# EasyEDA schematic IR-Controle-PC_EasyEDA.json
TITLE: Sheet_1; REV: 1.0; Date: 2026-01-11; Sheet: 1/1; Drawn By: sidneyhimuro; Company: Your Company
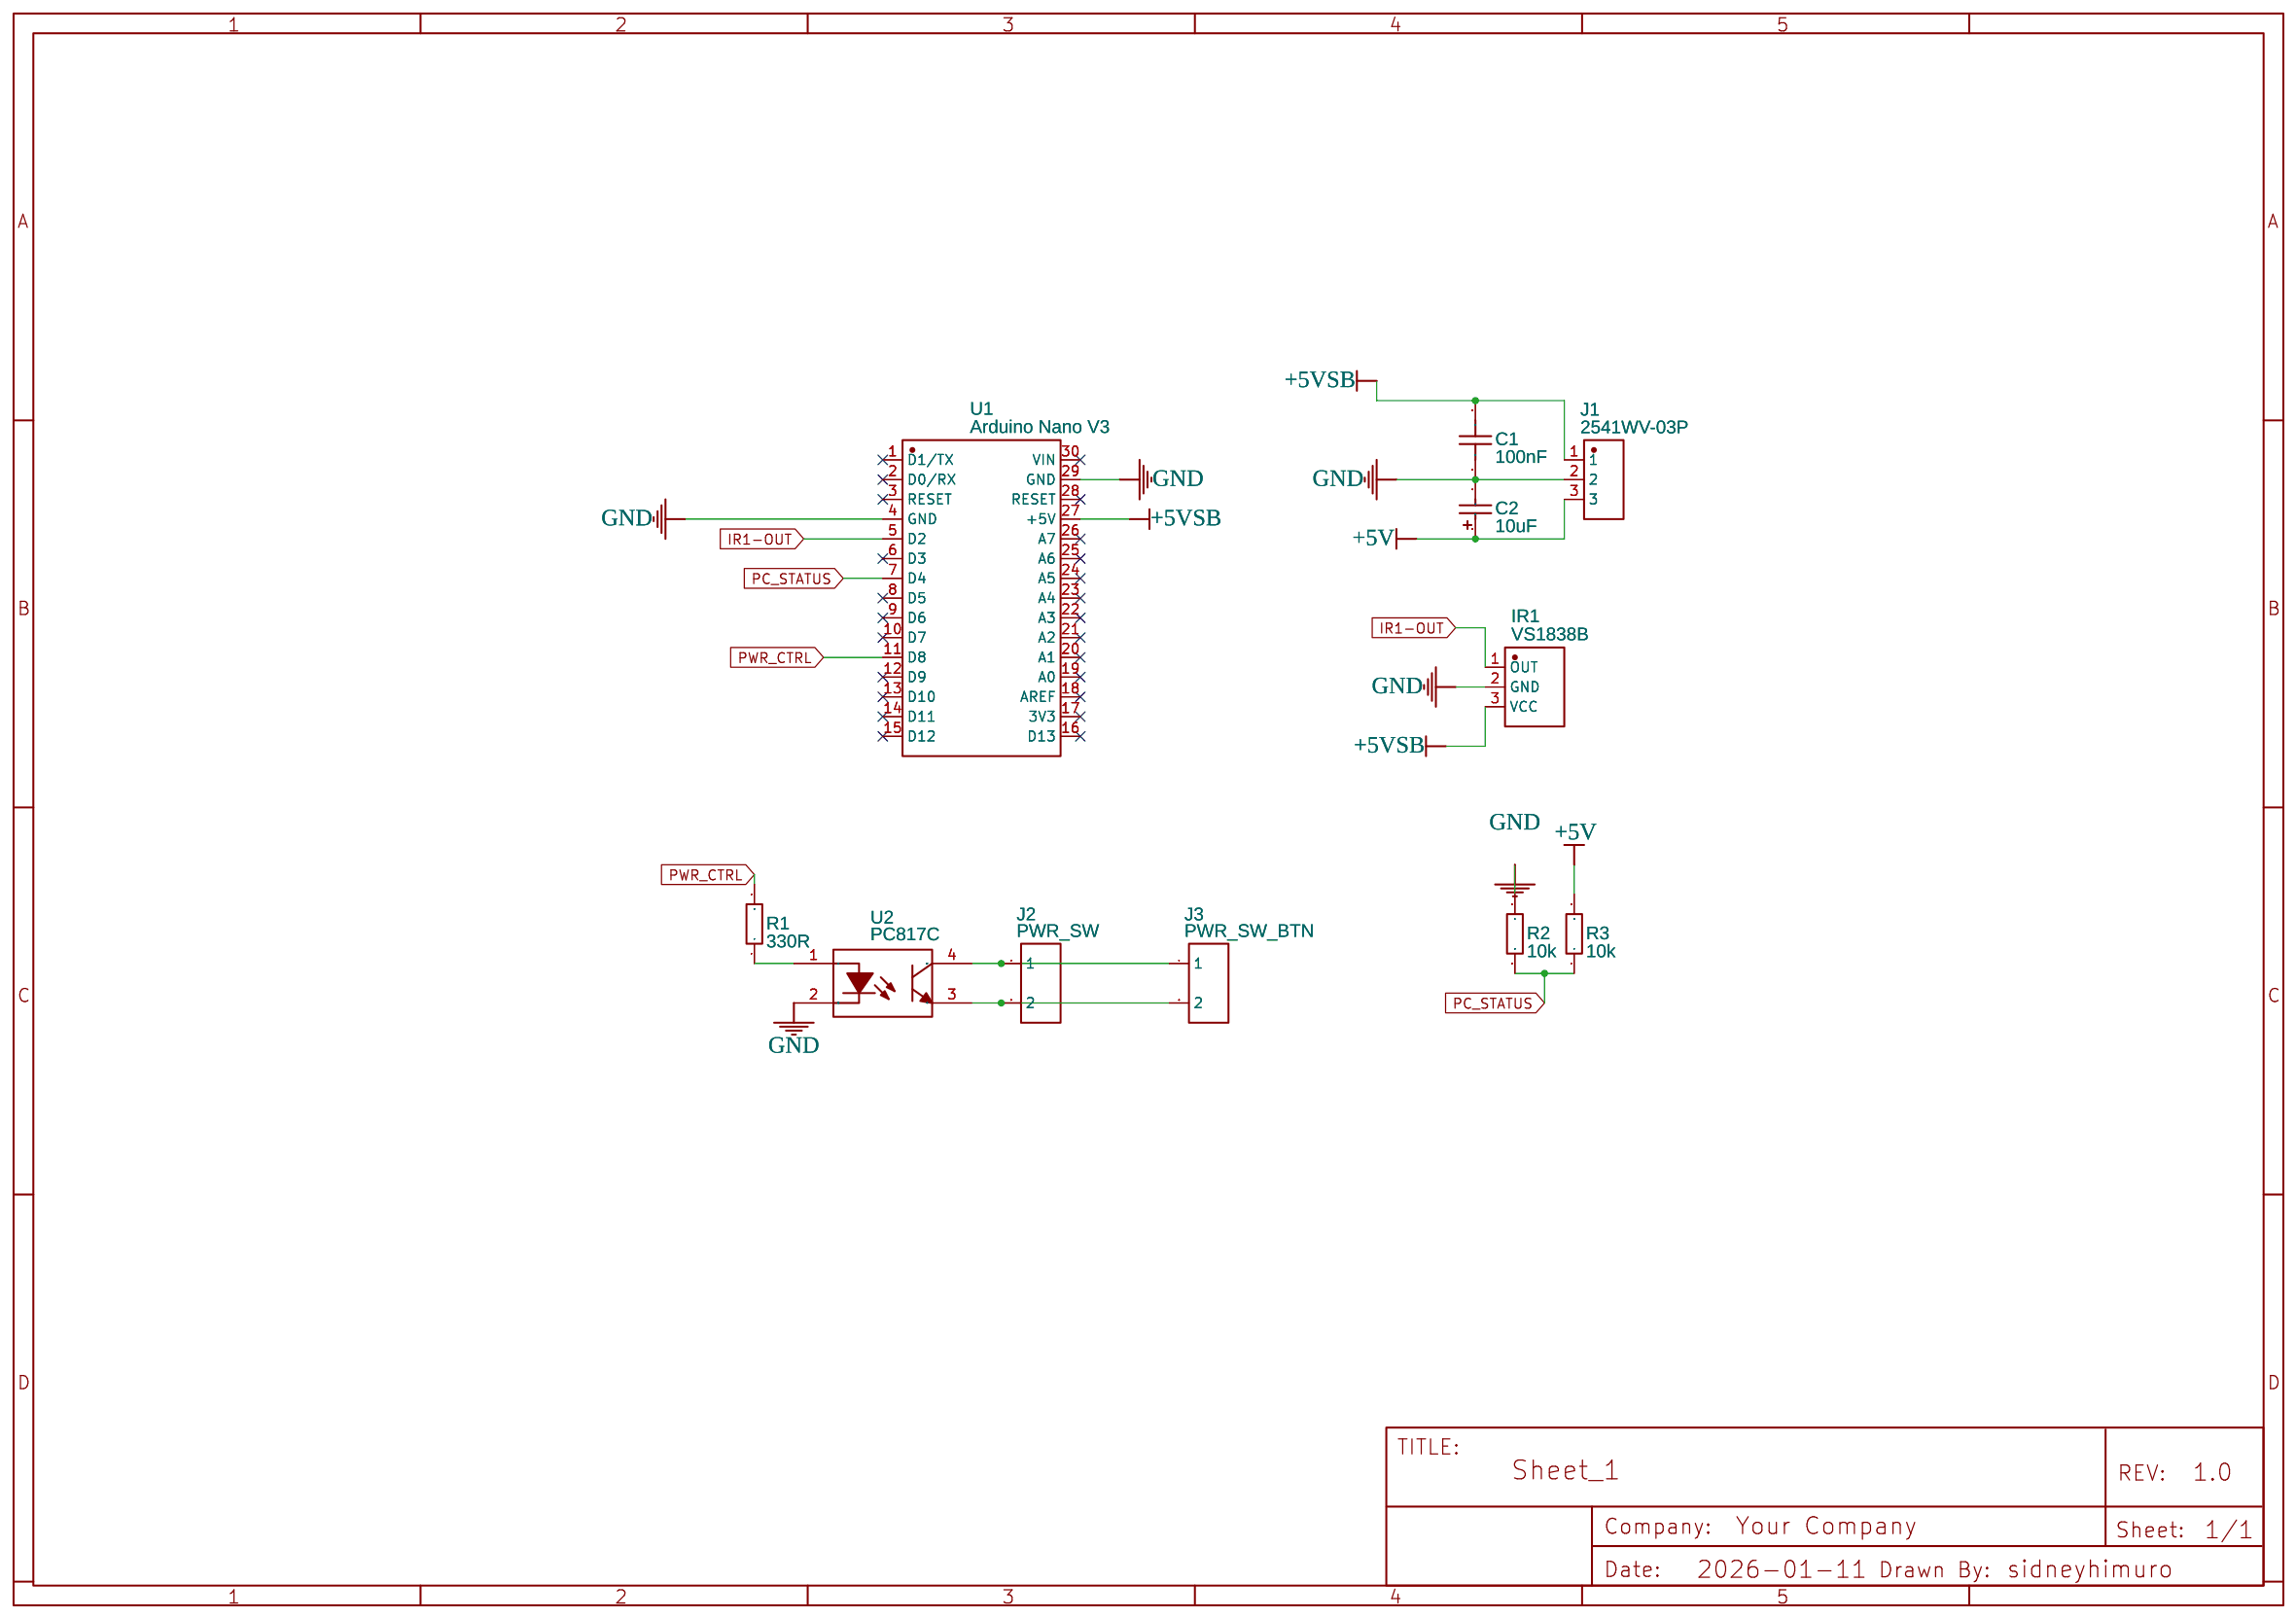
[diagram p0: schematic sheet]

## Parts
C1  100nF  [CAP-0.2]
C2  10uF  [CAP-TAN-S2.5]
IR1  VS1838B  [OPTO-TH_VS1838B]
J1  2541WV-03P  [HDR-TH_3P-P2.54-V-M-2]
J2  PWR_SW  [HDR-TH_2P-P2.54-V-M-1]
J3  PWR_SW_BTN  [HDR-TH_2P-P2.54-V-M-1]
R1  330R  [AXIAL-0.3]
R2  10k  [AXIAL-0.3]
R3  10k  [AXIAL-0.3]
U1  Arduino Nano V3  [COMM-TH_ARDUINO_NANO]
U2  PC817C  [DIP-4_L4.6-W6.5-P2.54-LS7.6-BL]

## Library data of the parts
C1 = CT4-0805B103K500F3: Supplier: LCSC; Manufacturer: FH; Contributor: LCSC; Supplier Part: C94713
C2 = TAP106K035SCS: Supplier: LCSC; Manufacturer: AVX; Supplier Part: C73787
IR1 = VS1838B: Contributor: LCSC; Supplier: LCSC; Supplier Part: C9900002107; Manufacturer: null; JLCPCB Part Class: Extended Part
J1 = 2541WV-03P: Contributor: lcsc; Supplier: LCSC; Supplier Part: C5383112; Manufacturer: HanElectricity(瀚源); JLCPCB Part Class: Extended Part
J2 J3 = Header-Male-2.54_1x2: Supplier: LCSC; Manufacturer: TE Connectivity(泰科电子); Manufacturer Part: 826629-2; Supplier Part: C86471; JLCPCB Part Class: Extended Part
R1-R3 = Res_AXIAL-0.3(1/8W)_EU: Manufacturer Part: ?
U1 = ARDUINO_NANO: Contributor: lcsc; Supplier: LCSC; Supplier Part: C9900017879; Manufacturer: null; JLCPCB Part Class: Extended Part
U2 = PC817C: Contributor: LCSC; Supplier: LCSC; Supplier Part: C115500; Manufacturer: 华润华晶; JLCPCB Part Class: Extended Part

## Nets
+5V: C2.1 J1.3 R3.2
+5VSB: C1.2 IR1.3(VCC) J1.1 U1.27(+5V)
GND: C1.1 C2.2 IR1.2(GND) J1.2 R2.1 U1.4(GND) U1.29(GND) U2.2(CAT)
IR1-OUT: IR1.1(OUT) U1.5(D2)
PC_STATUS: R2.2 R3.1 U1.7(D4)
PWR_CTRL: R1.2 U1.11(D8)
Net-(J2-1): J2.1 J3.1 U2.4(COL)
Net-(J2-2): J2.2 J3.2 U2.3(EM)
Net-(R1-1): R1.1 U2.1(AN)

Not connected (* = marked no-connect by the designer): U1 1(D1/TX)* 2(D0/RX)* 3(RESET)* 6(D3)* 8(D5)* 9(D6)* 10(D7)* 12(D9)* 13(D10)* 14(D11)* 15(D12)* 16(D13)* 17(3V3)* 18(AREF)* 19(A0)* 20(A1)* 21(A2)* 22(A3)* 23(A4)* 24(A5)* 25(A6)* 26(A7)* 28(RESET)* 30(VIN)*
